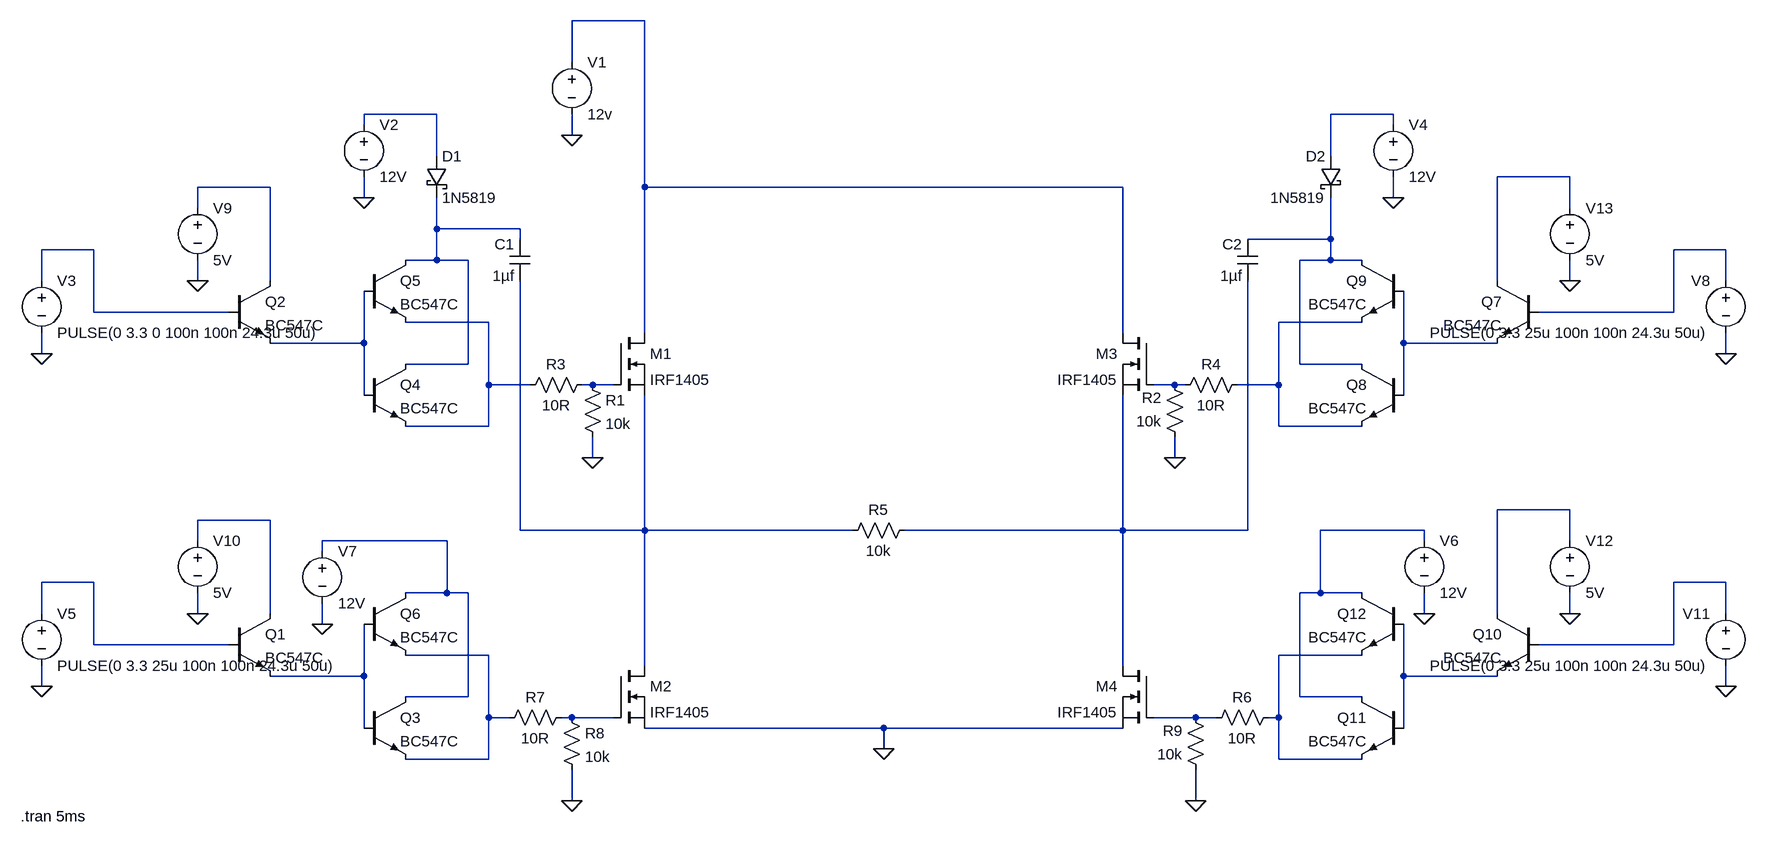
[diagram p0: schematic Draft1.asc]
Draft1.asc, the LTspice schematic file:
Version 4.1
SHEET 1 2564 696
WIRE 464 -544 352 -544
WIRE 352 -480 352 -544
WIRE 144 -400 32 -400
WIRE 1616 -400 1520 -400
WIRE 32 -384 32 -400
WIRE 1616 -384 1616 -400
WIRE 352 -368 352 -400
WIRE 144 -336 144 -400
WIRE 1520 -336 1520 -400
WIRE 1888 -304 1776 -304
WIRE -112 -288 -224 -288
WIRE 464 -288 464 -544
WIRE 1200 -288 464 -288
WIRE 32 -272 32 -304
WIRE 1616 -272 1616 -304
WIRE -224 -256 -224 -288
WIRE 1888 -256 1888 -304
WIRE 144 -224 144 -272
WIRE 272 -224 144 -224
WIRE 272 -208 272 -224
WIRE 1520 -208 1520 -272
WIRE 1520 -208 1392 -208
WIRE -384 -192 -464 -192
WIRE 2128 -192 2048 -192
WIRE 144 -176 144 -224
WIRE 144 -176 96 -176
WIRE 192 -176 144 -176
WIRE 1520 -176 1520 -208
WIRE 1520 -176 1472 -176
WIRE 1568 -176 1520 -176
WIRE -464 -144 -464 -192
WIRE -224 -144 -224 -176
WIRE -112 -144 -112 -288
WIRE 1776 -144 1776 -304
WIRE 1888 -144 1888 -176
WIRE 2128 -144 2128 -192
WIRE -384 -96 -384 -192
WIRE -176 -96 -384 -96
WIRE 2048 -96 2048 -192
WIRE 2048 -96 1840 -96
WIRE 224 -80 96 -80
WIRE 1568 -80 1440 -80
WIRE 464 -64 464 -288
WIRE 1200 -64 1200 -288
WIRE 32 -48 32 -128
WIRE 32 -48 -112 -48
WIRE 1632 -48 1632 -128
WIRE 1776 -48 1632 -48
WIRE -464 -32 -464 -64
WIRE 2128 -32 2128 -64
WIRE 192 -16 192 -176
WIRE 192 -16 96 -16
WIRE 1472 -16 1472 -176
WIRE 1568 -16 1472 -16
WIRE 224 16 224 -80
WIRE 288 16 224 16
WIRE 384 16 368 16
WIRE 416 16 384 16
WIRE 1280 16 1248 16
WIRE 1296 16 1280 16
WIRE 1440 16 1440 -80
WIRE 1440 16 1376 16
WIRE 32 32 32 -48
WIRE 1632 32 1632 -48
WIRE 224 80 224 16
WIRE 224 80 96 80
WIRE 1440 80 1440 16
WIRE 1568 80 1440 80
WIRE 384 128 384 96
WIRE 1280 128 1280 96
WIRE 1888 208 1776 208
WIRE -112 224 -224 224
WIRE 272 240 272 -144
WIRE 464 240 464 32
WIRE 464 240 272 240
WIRE 784 240 464 240
WIRE 1200 240 1200 32
WIRE 1200 240 864 240
WIRE 1392 240 1392 -144
WIRE 1392 240 1200 240
WIRE 1664 240 1504 240
WIRE -224 256 -224 224
WIRE 160 256 -32 256
WIRE 1664 256 1664 240
WIRE 1888 256 1888 208
WIRE -32 272 -32 256
WIRE -384 320 -464 320
WIRE 2128 320 2048 320
WIRE 160 336 160 256
WIRE 160 336 96 336
WIRE 192 336 160 336
WIRE 1504 336 1504 240
WIRE 1504 336 1472 336
WIRE 1568 336 1504 336
WIRE -464 368 -464 320
WIRE -224 368 -224 336
WIRE -112 368 -112 224
WIRE 1664 368 1664 336
WIRE 1776 368 1776 208
WIRE 1888 368 1888 336
WIRE 2128 368 2128 320
WIRE -32 384 -32 352
WIRE -384 416 -384 320
WIRE -176 416 -384 416
WIRE 2048 416 2048 320
WIRE 2048 416 1840 416
WIRE 224 432 96 432
WIRE 1568 432 1440 432
WIRE 464 448 464 240
WIRE 1200 448 1200 240
WIRE 32 464 32 384
WIRE 32 464 -112 464
WIRE 1632 464 1632 384
WIRE 1776 464 1632 464
WIRE -464 480 -464 448
WIRE 2128 480 2128 448
WIRE 192 496 192 336
WIRE 192 496 96 496
WIRE 1472 496 1472 336
WIRE 1568 496 1472 496
WIRE 224 528 224 432
WIRE 256 528 224 528
WIRE 352 528 336 528
WIRE 416 528 352 528
WIRE 1312 528 1248 528
WIRE 1344 528 1312 528
WIRE 1440 528 1440 432
WIRE 1440 528 1424 528
WIRE 32 544 32 464
WIRE 832 544 464 544
WIRE 1200 544 832 544
WIRE 1632 544 1632 464
WIRE 832 576 832 544
WIRE 224 592 224 528
WIRE 224 592 96 592
WIRE 1440 592 1440 528
WIRE 1568 592 1440 592
WIRE 352 656 352 608
WIRE 1312 656 1312 608
FLAG -464 -32 0
FLAG -464 480 0
FLAG 2128 -32 0
FLAG 2128 480 0
FLAG 832 576 0
FLAG 384 128 0
FLAG 1280 128 0
FLAG 352 656 0
FLAG 1312 656 0
FLAG 352 -368 0
FLAG 32 -272 0
FLAG 1616 -272 0
FLAG 1664 368 0
FLAG -32 384 0
FLAG -224 -144 0
FLAG -224 368 0
FLAG 1888 368 0
FLAG 1888 -144 0
SYMBOL npn -176 -144 R0
SYMATTR InstName Q2
SYMATTR Value BC547C
SYMBOL nmos 416 -64 R0
SYMATTR InstName M1
SYMATTR Value IRF1405
SYMBOL npn 32 -16 R0
SYMATTR InstName Q4
SYMATTR Value BC547C
SYMBOL npn 32 -176 R0
SYMATTR InstName Q5
SYMATTR Value BC547C
SYMBOL voltage -464 -160 R0
WINDOW 123 0 0 Left 0
WINDOW 39 0 0 Left 0
SYMATTR InstName V3
SYMATTR Value PULSE(0 3.3 0 100n 100n 24.3u 50u)
SYMBOL npn -176 368 R0
SYMATTR InstName Q1
SYMATTR Value BC547C
SYMBOL nmos 416 448 R0
SYMATTR InstName M2
SYMATTR Value IRF1405
SYMBOL npn 32 496 R0
SYMATTR InstName Q3
SYMATTR Value BC547C
SYMBOL npn 32 336 R0
SYMATTR InstName Q6
SYMATTR Value BC547C
SYMBOL schottky 128 -336 R0
SYMATTR InstName D1
SYMATTR Value 1N5819
SYMATTR Description Diode
SYMATTR Type diode
SYMBOL npn 1840 -144 M0
SYMATTR InstName Q7
SYMATTR Value BC547C
SYMBOL nmos 1248 -64 M0
SYMATTR InstName M3
SYMATTR Value IRF1405
SYMBOL npn 1632 -16 M0
SYMATTR InstName Q8
SYMATTR Value BC547C
SYMBOL npn 1632 -176 M0
SYMATTR InstName Q9
SYMATTR Value BC547C
SYMBOL npn 1840 368 M0
SYMATTR InstName Q10
SYMATTR Value BC547C
SYMBOL nmos 1248 448 M0
SYMATTR InstName M4
SYMATTR Value IRF1405
SYMBOL npn 1632 496 M0
SYMATTR InstName Q11
SYMATTR Value BC547C
SYMBOL npn 1632 336 M0
SYMATTR InstName Q12
SYMATTR Value BC547C
SYMBOL schottky 1536 -336 M0
SYMATTR InstName D2
SYMATTR Value 1N5819
SYMATTR Description Diode
SYMATTR Type diode
SYMBOL res 368 0 R0
SYMATTR InstName R1
SYMATTR Value 10k
SYMBOL res 1296 112 R180
WINDOW 0 36 76 Left 2
WINDOW 3 36 40 Left 2
SYMATTR InstName R2
SYMATTR Value 10k
SYMBOL res 384 0 R90
WINDOW 0 0 56 VBottom 2
WINDOW 3 32 56 VTop 2
SYMATTR InstName R3
SYMATTR Value 10R
SYMBOL res 1392 0 R90
WINDOW 0 0 56 VBottom 2
WINDOW 3 32 56 VTop 2
SYMATTR InstName R4
SYMATTR Value 10R
SYMBOL cap 288 -208 M0
WINDOW 3 24 56 Left 2
SYMATTR InstName C1
SYMATTR Value 1µf
SYMATTR Description Capacitor
SYMATTR Type cap
SYMATTR SpiceLine V=16 Irms=0 Rser=11 Lser=0 mfg="AVX" pn="TAJA105K016" type="Tantalum"
SYMBOL cap 1408 -208 M0
WINDOW 3 24 56 Left 2
SYMATTR InstName C2
SYMATTR Value 1µf
SYMATTR Description Capacitor
SYMATTR Type cap
SYMATTR SpiceLine V=16 Irms=0 Rser=11 Lser=0 mfg="AVX" pn="TAJA105K016" type="Tantalum"
SYMBOL voltage -464 352 R0
WINDOW 123 0 0 Left 0
WINDOW 39 0 0 Left 0
SYMATTR InstName V5
SYMATTR Value PULSE(0 3.3 25u 100n 100n 24.3u 50u)
SYMBOL voltage 2128 -160 M0
WINDOW 123 0 0 Left 0
WINDOW 39 0 0 Left 0
SYMATTR InstName V8
SYMATTR Value PULSE(0 3.3 25u 100n 100n 24.3u 50u)
SYMBOL res 880 224 R90
WINDOW 0 0 56 VBottom 2
WINDOW 3 32 56 VTop 2
SYMATTR InstName R5
SYMATTR Value 10k
SYMBOL res 1440 512 R90
WINDOW 0 0 56 VBottom 2
WINDOW 3 32 56 VTop 2
SYMATTR InstName R6
SYMATTR Value 10R
SYMBOL res 352 512 R90
WINDOW 0 0 56 VBottom 2
WINDOW 3 32 56 VTop 2
SYMATTR InstName R7
SYMATTR Value 10R
SYMBOL res 336 512 R0
SYMATTR InstName R8
SYMATTR Value 10k
SYMBOL res 1328 624 R180
WINDOW 0 36 76 Left 2
WINDOW 3 36 40 Left 2
SYMATTR InstName R9
SYMATTR Value 10k
SYMBOL voltage 2128 352 M0
WINDOW 123 0 0 Left 0
WINDOW 39 0 0 Left 0
SYMATTR InstName V11
SYMATTR Value PULSE(0 3.3 25u 100n 100n 24.3u 50u)
SYMBOL voltage 352 -496 R0
WINDOW 123 0 0 Left 0
WINDOW 39 0 0 Left 0
SYMATTR InstName V1
SYMATTR Value 12v
SYMBOL voltage 32 -400 R0
WINDOW 123 0 0 Left 0
WINDOW 39 0 0 Left 0
SYMATTR InstName V2
SYMATTR Value 12V
SYMBOL voltage 1616 -400 R0
WINDOW 123 0 0 Left 0
WINDOW 39 0 0 Left 0
SYMATTR InstName V4
SYMATTR Value 12V
SYMBOL voltage 1664 240 R0
WINDOW 123 0 0 Left 0
WINDOW 39 0 0 Left 0
SYMATTR InstName V6
SYMATTR Value 12V
SYMBOL voltage -32 256 R0
WINDOW 123 0 0 Left 0
WINDOW 39 0 0 Left 0
SYMATTR InstName V7
SYMATTR Value 12V
SYMBOL voltage -224 -272 R0
SYMATTR InstName V9
SYMATTR Value 5V
SYMBOL voltage -224 240 R0
SYMATTR InstName V10
SYMATTR Value 5V
SYMBOL voltage 1888 240 R0
SYMATTR InstName V12
SYMATTR Value 5V
SYMBOL voltage 1888 -272 R0
WINDOW 123 0 0 Left 0
WINDOW 39 0 0 Left 0
SYMATTR InstName V13
SYMATTR Value 5V
TEXT -496 680 Left 2 !.tran 5ms

The netlist it stands for:
* Draft1.asc
Q2 N005 N008 N012 0 BC547C
M1 N001 N014 N018 N018 IRF1405
Q4 N006 N012 N010 0 BC547C
Q5 N006 N012 N010 0 BC547C
V3 N008 0 PULSE(0 3.3 0 100n 100n 24.3u 50u)
Q1 N017 N022 N026 0 BC547C
M2 N018 N028 0 0 IRF1405
Q3 N021 N026 N024 0 BC547C
Q6 N021 N026 N024 0 BC547C
D1 N002 N006 1N5819
Q7 N004 N009 N013 0 BC547C
M3 N001 N015 N019 N019 IRF1405
Q8 N007 N013 N011 0 BC547C
Q9 N007 N013 N011 0 BC547C
Q10 N016 N023 N027 0 BC547C
M4 N019 N029 0 0 IRF1405
Q11 N020 N027 N025 0 BC547C
Q12 N020 N027 N025 0 BC547C
D2 N003 N007 1N5819
R1 N014 0 10k
R2 0 N015 10k
R3 N014 N010 10R
R4 N011 N015 10R
C1 N006 N018 1µf V=16 Irms=0 Rser=11 Lser=0 mfg="AVX" pn="TAJA105K016" type="Tantalum"
C2 N007 N019 1µf V=16 Irms=0 Rser=11 Lser=0 mfg="AVX" pn="TAJA105K016" type="Tantalum"
V5 N022 0 PULSE(0 3.3 25u 100n 100n 24.3u 50u)
V8 N009 0 PULSE(0 3.3 25u 100n 100n 24.3u 50u)
R5 N019 N018 10k
R6 N025 N029 10R
R7 N028 N024 10R
R8 N028 0 10k
R9 0 N029 10k
V11 N023 0 PULSE(0 3.3 25u 100n 100n 24.3u 50u)
V1 N001 0 12v
V2 N002 0 12V
V4 N003 0 12V
V6 N020 0 12V
V7 N021 0 12V
V9 N005 0 5V
V10 N017 0 5V
V12 N016 0 5V
V13 N004 0 5V
.model D D
.lib standard.dio
.model NPN NPN
.model PNP PNP
.lib standard.bjt
.model NMOS NMOS
.model PMOS PMOS
.lib standard.mos
.tran 5ms
.backanno
.end